# Altium schematic sheet CAN_24bit_airspeed.SchDoc
size A4; DrawnBy: Philip Rowse
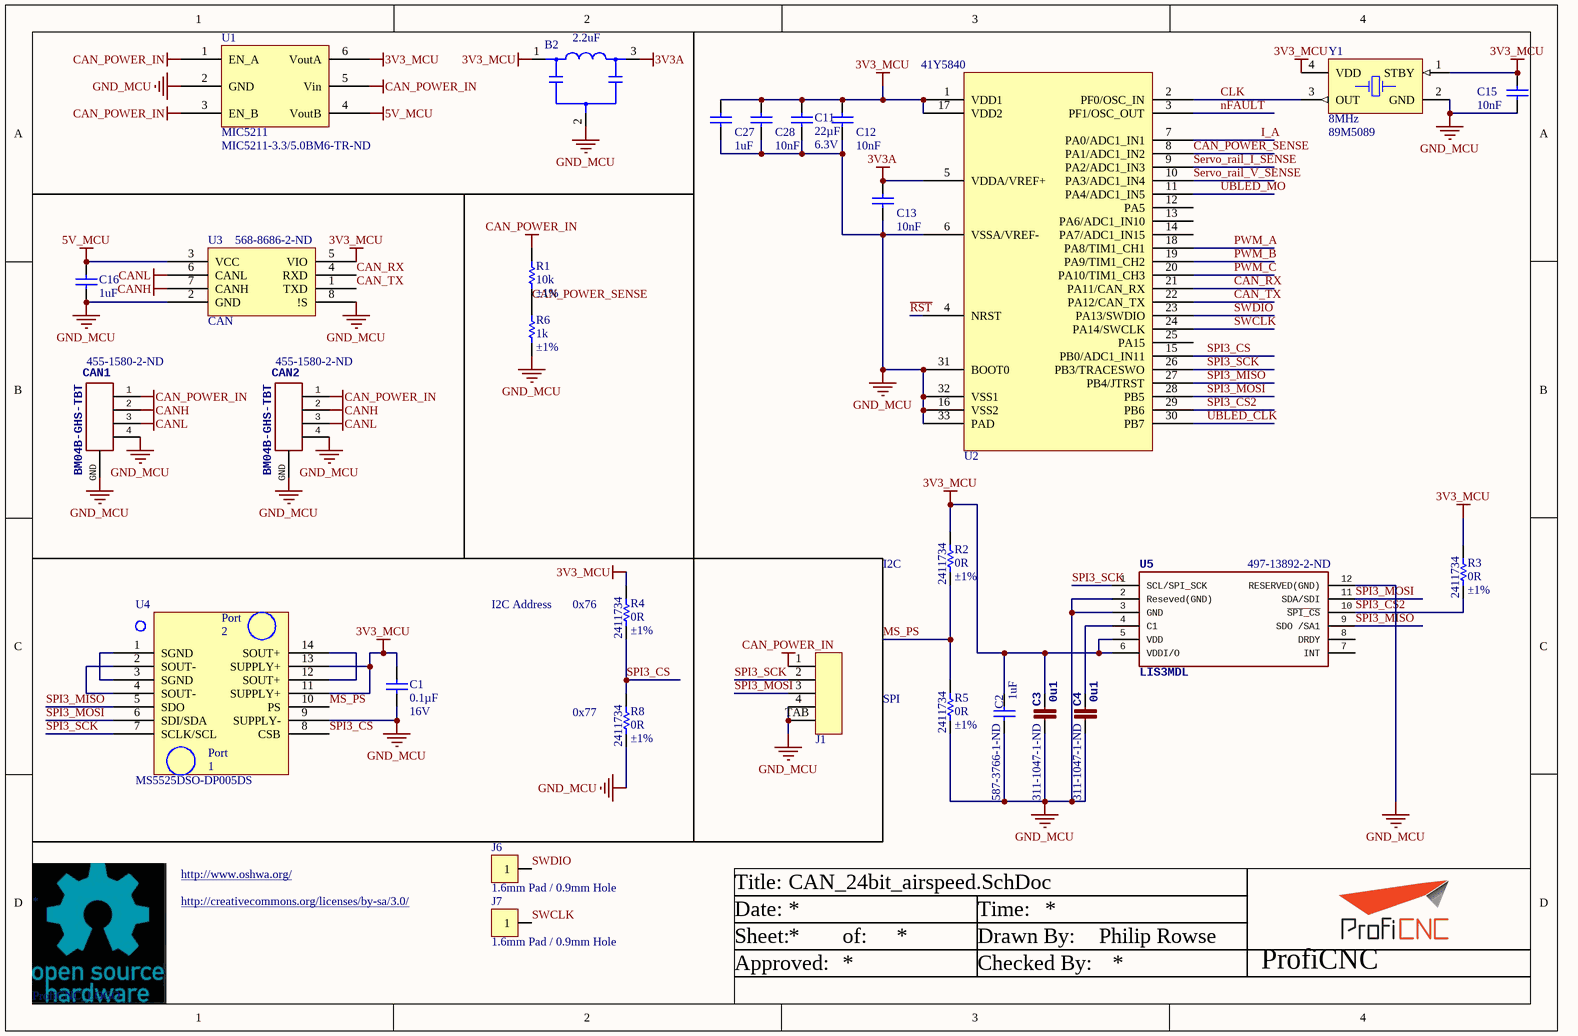
[diagram p0: CAN_24bit_airspeed.SchDoc]

## Parts
*  ProfiCNC_LOGO  [ProfiCNC_medium]  (no BOM)
B2  value 2.2uF  [NFM18CC]  (hidden comment: Filter)
C1  value 0.1µF  Voltage: 16V  [C0402]  (hidden comment: CAP)
C2  value 1uF  Supplier Part Number 1: 587-3766-1-ND  [CAPC1005L]  (hidden comment: Cap)
C3  0u1  Supplier Part Number 1: 311-1047-1-ND  [C0402]
C4  0u1  Supplier Part Number 1: 311-1047-1-ND  [C0402]
C11  value 22µF  Voltage: 6.3V  [C0805]  (hidden comment: CAP)
C12  value 10nF  [CAPC1005L]  (hidden comment: CAP CER 10000PF 50V X7R 0402)
C13  value 10nF  [CAPC1005L]  (hidden comment: CAP CER 10000PF 50V X7R 0402)
C15  value 10nF  [CAPC1005L]  (hidden comment: CAP CER 10000PF 50V X7R 0402)
C16  value 1uF  [CAPC1005L]  (hidden comment: Cap)
C27  value 1uF  [CAPC1005L]  (hidden comment: Cap)
C28  value 10nF  [CAPC1005L]  (hidden comment: CAP CER 10000PF 50V X7R 0402)
CAN1  BM04B-GHS-TBT  Supplier Part Number 1: 455-1580-2-ND  [BM04-GHS-TBT]
CAN2  BM04B-GHS-TBT  Supplier Part Number 1: 455-1580-2-ND  [BM04-GHS-TBT]
J1  HDR_TAB_1x4  [DF13C-4P-1.25V]  (value not drawn)
J6  1.6mm Pad / 0.9mm Hole  [1.6mm Pad / 0.9mm Hole]
J7  1.6mm Pad / 0.9mm Hole  [1.6mm Pad / 0.9mm Hole]
R1  value 10k  Tolerance: ±1%  [R0402]  (hidden comment: RES)
R2  value 0R  Tolerance: ±1%  Supplier Part Number 1: 2411734  [R0402]  (hidden comment: RES)
R3  value 0R  Tolerance: ±1%  Supplier Part Number 1: 2411734  [R0402]  (hidden comment: RES)
R4  value 0R  Tolerance: ±1%  Supplier Part Number 1: 2411734  [R0402]  (hidden comment: RES)
R5  value 0R  Tolerance: ±1%  Supplier Part Number 1: 2411734  [R0402]  (hidden comment: RES)
R6  value 1k  Tolerance: ±1%  [R0402]  (hidden comment: RES)
R8  value 0R  Tolerance: ±1%  Supplier Part Number 1: 2411734  [R0402]  (hidden comment: RES)
U1  MIC5211  Supplier Part Number 1: MIC5211-3.3/5.0BM6-TR-ND  [SOT23-6]
U2  Supplier Part Number 1: 41Y5840  [QFN50P500X500X60-32L]  (hidden comment: IC MCU M4 64KB FLASH 32UFQFPN)
U3  CAN  Supplier Part Number 1: 568-8686-2-ND  [SON65P300X100_HS-9N]
U4  MS5525DSO-DP005DS  [MS5525DSO]
U5  LIS3MDL  Supplier Part Number 1: 497-13892-2-ND  [LIS3MDL]
Y1  value 8MHz  Supplier Part Number 1: 89M5089  [CS325]  (hidden comment: Oscillator)

## Nets
3V3_MCU: B2.1(IN) C1.1 C2.1 C3.P$1 C11.1 C12.2 C15.2 C27.1 C28.2 R2.1 R3.1 R4.1 U1.6(VoutA) U2.1(VDD1) U2.17(VDD2) U3.5(VIO) U4.11(SUPPLY+) U4.13(SUPPLY+) U5.5(VDD) U5.6(VDDI/O) Y1.1(STBY) Y1.4(VDD)
3V3A: B2.3(OUT) C13.2 U2.5(VDDA/VREF+)
5V_MCU: C16.2 U1.4(VoutB) U3.3(VCC)
CAN_POWER_IN: CAN1.1 CAN2.1 J1.1 R1.1 U1.1(EN_A) U1.3(EN_B) U1.5(Vin)
CANH: CAN1.2 CAN2.2 U3.7(CANH)
CANL: CAN1.3 CAN2.3 U3.6(CANL)
GND_MCU: B2.2(GND) C1.2 C2.2 C3.P$2 C4.P$2 C11.2 C12.1 C13.1 C15.1 C16.1 C27.2 C28.1 CAN1.4 CAN1.GND CAN2.4 CAN2.GND J1.4 J1.TAB R5.2 R6.2 R8.2 U1.2(GND) U2.6(VSSA/VREF-) U2.16(VSS2) U2.31(BOOT0) U2.32(VSS1) U2.33(PAD) U3.2(GND) U3.8(!S) U4.9(SUPPLY-) U5.2(Reseved(GND)) U5.3(GND) U5.12(RESERVED(GND)) Y1.2(GND)
CAN_POWER_SENSE: R1.2 R6.1 U2.8(PA1/ADC1_IN2)
CAN_RX: U2.21(PA11/CAN_RX) U3.4(RXD)
CAN_TX: U2.22(PA12/CAN_TX) U3.1(TXD)
CLK: U2.2(PF0/OSC_IN) Y1.3(OUT)
I_A: U2.7(PA0/ADC1_IN1)
MS_PS: R2.2 R5.1 U4.10(PS)
nFAULT: U2.3(PF1/OSC_OUT)
PWM_A: U2.18(PA8/TIM1_CH1)
PWM_B: U2.19(PA9/TIM1_CH2)
PWM_C: U2.20(PA10/TIM1_CH3)
~{RST}: U2.4(NRST)
Servo_rail_I_SENSE: U2.9(PA2/ADC1_IN3)
Servo_rail_V_SENSE: U2.10(PA3/ADC1_IN4)
SPI3_CS: R4.2 R8.1 U2.15(PB0/ADC1_IN11) U4.8(CSB)
SPI3_CS2: R3.2 U2.29(PB6) U5.10(~{SPI_CS})
SPI3_MISO: U2.27(PB4/JTRST) U4.5(SDO) U5.9(SDO_/SA1)
SPI3_MOSI: J1.3 U2.28(PB5) U4.6(SDI/SDA) U5.11(SDA/SDI)
SPI3_SCK: J1.2 U2.26(PB3/TRACESWO) U4.7(SCLK/SCL) U5.1(SCL/SPI_SCK)
SWCLK: J7.1 U2.24(PA14/SWCLK)
SWDIO: J6.1 U2.23(PA13/SWDIO)
UBLED_CLK: U2.30(PB7)
UBLED_MO: U2.11(PA4/ADC1_IN5)
NetC4_P$1: C4.P$1 U5.4(C1)
NetU4_1: U4.1(SGND) U4.3(SGND)
NetU4_2: U4.2(SOUT-) U4.4(SOUT-)
NetU4_12: U4.12(SOUT+) U4.14(SOUT+)

Not connected (* = marked no-connect by the designer): U2 12(PA5) 13(PA6/ADC1_IN10) 14(PA7/ADC1_IN15) 25(PA15); U5 7(INT) 8(DRDY)

## Notes on the sheet
- (near R2) I2C
- I2C Address
- (near R4) 0x76
- (near R8) 0x77
- SPI
- http://www.oshwa.org/
- http://creativecommons.org/licenses/by-sa/3.0/
- Title:
- Date:
- Time:
- Sheet:
- Approved:
- of:
- Drawn By:
- Checked By:
- ProfiCNC
- (in symbol MS5525DSO-DP) Port

## Library data of the parts
B2 = NFM18CC222R1C3: EMIFIL (Capacitor type) Single Circuit Type for Signal Lines; PartNumber: NFM18PC225B1A3D; Manufacturer: Murata Electronics North America; Supplier 1: Digi-Key; Supplier Part Number 1: 490-6972-1-ND
C1 = C01050: CAP CER 0.1UF 16V X7R 0402; Part Number: C01050; Manufacturer: Murata Electronics North America; Manufacturer Part Number: GRM155R71C104KA88D; Tolerance: ±10%; Supplier 1: Digi-Key; Supplier Part Number 1: 490-3261-1-ND; HelpURL: http://www.murata.com/~/media/webrenewal/support/library/catalog/products/capacitor/mlcc/c02e.ashx; Operating Temperature: -55°C ~ 125°C; Type: CER; Temperature Coefficient: X7R
C2 C16 C27 = Cap: CAP CER 1UF 6.3V X5R 0402; PartNumber: JMK105BJ105KVHF; Supplier 1: Digi-Key
  C16 C27: Supplier Part Number 1: 587-3766-1-ND
C3 C4 = CAP0402: CAP CER 0.1UF 16V Y5V 0402; 3DR_PARTNO: ECM0700; PARTNO: CC0402ZRY5V7BB104; Supplier 1: Digi-Key; Value: 0u1
C11 = C01690: CAP CER 22UF 6.3V X5R 0805; Part Number: C01690; Manufacturer: Murata Electronics North America; Manufacturer Part Number: GRM21BR60J226ME39L; Tolerance: ±20%; Supplier 1: Digi-Key; Supplier Part Number 1: 490-1719-1-ND; HelpURL: http://www.murata.com/~/media/webrenewal/support/library/catalog/products/capacitor/mlcc/c02e.ashx; Operating Temperature: -55°C ~ 85°C; Type: CER; Temperature Coefficient: X5R
C12 C13 C15 C28 = Cap: PartNumber: CGA2B3X7R1H103K050BB; Supplier 1: Digi-Key; Supplier Part Number 1: 445-6893-1-ND
CAN1 CAN2 = BM04B-GHS-TBT: PARTNO: 5023820470; Supplier 1: Digi-Key
J1 = J00015: CONN HEADER 4POS 1.25MM SMD GOLD; Part Number: J00015; Manufacturer: Hirose Electric Co Ltd; Manufacturer Part Number: DF13C-4P-1.25V(50); Connector Type: Header, Shrouded; Number of Positions: 4; Current Rating: 1A; Voltage - Rated: 150V; Series: DF13; Supplier 1: Digi-Key; Contact Type: Male Pin; Mounting Type: Surface Mount; Supplier Part Number 1: H3434-ND; HelpURL: http://www.hirose.co.jp/cataloge_hp/en_DF13_20130411.pdf; Pitch: 1.25mm; Operating Temperature: -35°C ~ 85°C; Contact Finish: Gold; Housing Color: Beige; Number of Rows: 1
J6 J7 = Connector 1x01
R1 = R00142: RES SMD 10K OHM 1% 1/16W 0402; Part Number: R00142; Manufacturer: Yageo; Manufacturer Part Number: RC0402FR-0710KL; Temperature Coefficient: ±100ppm/°C; Supplier 1: Digi-Key; Supplier Part Number 1: 311-10.0KLRCT-ND; HelpURL: http://www.yageo.com/NewPortal/yageodocoutput?fileName=/pdf/R-Chip/PYu-RC_Group_51_RoHS_L_3.pdf; Power: 1/16W; Operating Temperature: -55°C ~ 155°C
R2-R5 R8 = R00094: RES SMD 0R 1% 1/16W 0402; Part Number: R00094; Manufacturer: Yageo; Manufacturer Part Number: RC0402FR-071KL; Temperature Coefficient: ±100ppm/°C; HelpURL: http://www.yageo.com/NewPortal/yageodocoutput?fileName=/pdf/R-Chip/PYu-RC_Group_51_RoHS_L_3.pdf; Power: 1/16W; Operating Temperature: -55°C ~ 155°C; Supplier 1: Farnell
R6 = R00094: RES SMD 1K OHM 1% 1/16W 0402; Part Number: R00094; Manufacturer: Yageo; Manufacturer Part Number: RC0402FR-071KL; Temperature Coefficient: ±100ppm/°C; Supplier 1: Digi-Key; Supplier Part Number 1: 311-1.00KLRCT-ND; HelpURL: http://www.yageo.com/NewPortal/yageodocoutput?fileName=/pdf/R-Chip/PYu-RC_Group_51_RoHS_L_3.pdf; Power: 1/16W; Operating Temperature: -55°C ~ 155°C
U2 = STM32F302K8U6: 72 MHz Cortex-M4F MCU with 16 KB RAM, 64 KB flash; PartNumber: STM32F302K8U6; Supplier 1: Newark
U4 = MS5525DSO-DP
U5 = LIS3MDL: PARTNO: HMC5983; Supplier 1: Digi-Key
Y1 = ASE-12.000MHZ: 3.3V 8MHz XO Oscillator; PartNumber: ASE-8.000MHZ-LC-T; Manufacturer: Abracon Corporation; Supplier 1: Newark
U1 = MIC5211: Supplier 1: Digi-Key
U3 = CAN: Supplier 1: Digi-Key